# EAGLE design booster (EAGLE 6.4)
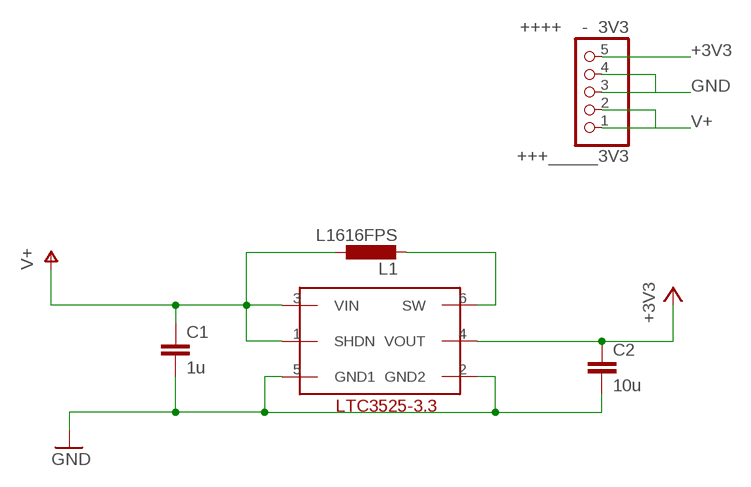
[diagram p0: schematic, sheet 1]

## Parts
+++_____3V3  ++++ - 3V3  PINHD-1X5  [1X05]
C1  1u  C-EUC0805  [C0805]
C2  10u  C-EUC0805  [C0805]
IC  LTC3525  [TSOT23-6]
L1  L1616FPS  [L1616]

## Nets
+3V3: +++_____3V3.5 C2.1 IC.4(VOUT)
GND: +++_____3V3.3 +++_____3V3.4 C1.2 C2.2 IC.2(GND2) IC.5(GND1)
N$3: IC.6(SW) L1.P$2
V+: +++_____3V3.1 +++_____3V3.2 C1.1 IC.1(SHDN) IC.3(VIN) L1.P$1

## Library data of the parts
+++_____3V3 = pinhead:PINHD-1X5: PIN HEADER
C1 C2 = rcl:C-EU: CAPACITOR, European symbol
IC = ltc3525:LTC3525
L1 = L1616FSR:L1616FPS

## Board
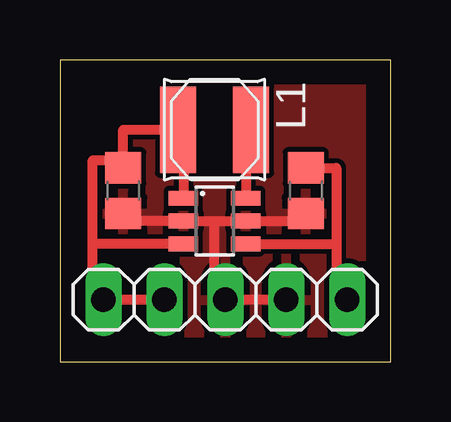
[diagram p1: board, top side]

Size 13.8 x 12.6 mm. Coordinates in mm from the lower left corner, seen from the top.
Outline: 0,0 13.8,0 13.8,12.6 0,12.6 0,0
Copper layers (1*16): Top 0.035mm / dielectric 1.5mm / Bottom 0.035mm
Design rules "default": minimum track width 10mil, minimum drill 24mil, track to track 8mil, track to pad 8mil, pad to pad 8mil, via to via 8mil, smd to smd 8mil, copper to edge 40mil, drill to drill 8mil, minimum pad ring 10mil, minimum via ring 8mil, stop-mask expansion 4mil, vias tented up to drill 0mil, thermal gap 10mil
tRestrict: area 6.1,7.9 to 7,12.2

### Footprints (pad centres in the part's own frame; a part is rotated, then mirrored left to right if it is on the bottom)
1X05 = drill 1.016 long: 1 -5.08,0; 2 -2.54,0; 3 0,0; 4 2.54,0; 5 5.08,0
C0805 = smd 1.3 x 1.5: 1 -0.95,0; 2 0.95,0
TSOT23-6 = smd 0.62 x 1.22: 1 -0.95,-1.3; 2 0,-1.3; 3 0.95,-1.3; 4 0.95,1.3; 5 0,1.3; 6 -0.95,1.3
L1616 = smd 1.5 x 3.6: P$1 -1.525,0; P$2 1.525,0

### Placement (x,y rotation side)
+++_____3V3  6.9,2.6 0 top
C1  2.64,7.15 270 top
C2  10.26,7.15 270 top
IC  6.45,5.88 270 top
L1  6.45,9.69 0 top

### Tracks (layer width: path | path; a pad name or v marks a point on that pad's centre or on a via)
+3V3
  Top 0.406: C2.1 11.53,8.1 11.53,4.93 | IC.4 11.53,4.93 | 11.53,4.93 11.53,2.6 +++_____3V3.5
GND
  Top 0.406: 6.45,5.88 IC.2 2.64,5.88 C1.2 | 6.45,5.88 IC.5 10.26,5.88 C2.2 | +++_____3V3.4 +++_____3V3.3 6.45,2.6 6.45,5.88
  pour Top: 0.1,-0.47 14.07,-0.47 14.07,12.23 0.1,12.23
N$3
  Top 0.406: L1.P$2 7.75,9.69 IC.6
V+
  Top 0.406: IC.1 5.15,9.69 L1.P$1 2.64,9.69 C1.1 2.64,8.42 1.37,8.42 1.37,4.93 | IC.3 1.37,4.93 | 1.37,4.93 1.37,2.6 +++_____3V3.1 +++_____3V3.2